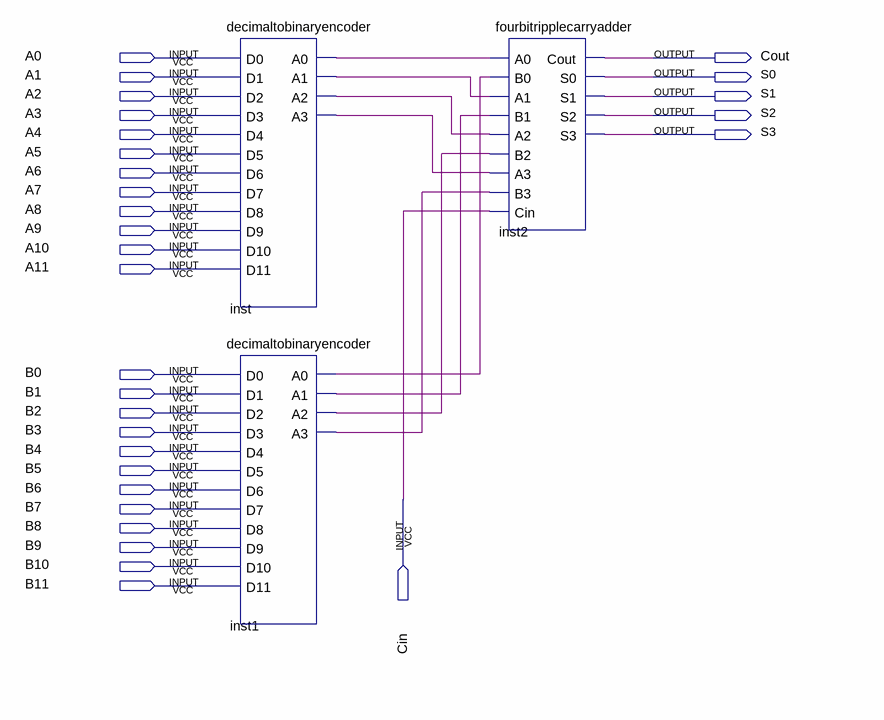
[diagram p0: schematic sheet]
// Quartus schematic week3_ex2.bdf as structural Verilog: 3 symbols, 30 pins
module week3_ex2 (
  input  A0,
  input  A1,
  input  A2,
  input  A3,
  input  A4,
  input  A5,
  input  A6,
  input  A7,
  input  A8,
  input  A9,
  input  A10,
  input  A11,
  input  B0,
  input  B1,
  input  B2,
  input  B3,
  input  B4,
  input  B5,
  input  B6,
  input  Cin,
  input  B7,
  input  B8,
  input  B9,
  input  B10,
  input  B11,
  output Cout,
  output S0,
  output S1,
  output S2,
  output S3
);

  wire inst1_a0, inst1_a1, inst1_a2, inst1_a3, inst_a0, inst_a1, inst_a2, inst_a3;

  decimaltobinaryencoder inst (
    .D0(A0), .D1(A1), .D2(A2), .D3(A3), .D4(A4), .D5(A5), .D6(A6), .D7(A7), .D8(A8), .D9(A9), .D10(A10),
    .D11(A11), .A0(inst_a0), .A1(inst_a1), .A2(inst_a2), .A3(inst_a3));
  decimaltobinaryencoder inst1 (
    .D0(B0), .D1(B1), .D2(B2), .D3(B3), .D4(B4), .D5(B5), .D6(B6), .D7(B7), .D8(B8), .D9(B9), .D10(B10),
    .D11(B11), .A0(inst1_a0), .A1(inst1_a1), .A2(inst1_a2), .A3(inst1_a3));
  fourbitripplecarryadder inst2 (
    .A0(inst_a0), .B0(inst1_a0), .A1(inst_a1), .B1(inst1_a1), .A2(inst_a2), .B2(inst1_a2), .A3(inst_a3),
    .B3(inst1_a3), .Cin(Cin), .Cout(Cout), .S0(S0), .S1(S1), .S2(S2), .S3(S3));
endmodule
